# EAGLE design Adafruit MCP4728 (EAGLE 9.5.1)
COMPANY: ADAFRUIT INDUSTRIES; DRAWN: KTOWN; REV: A
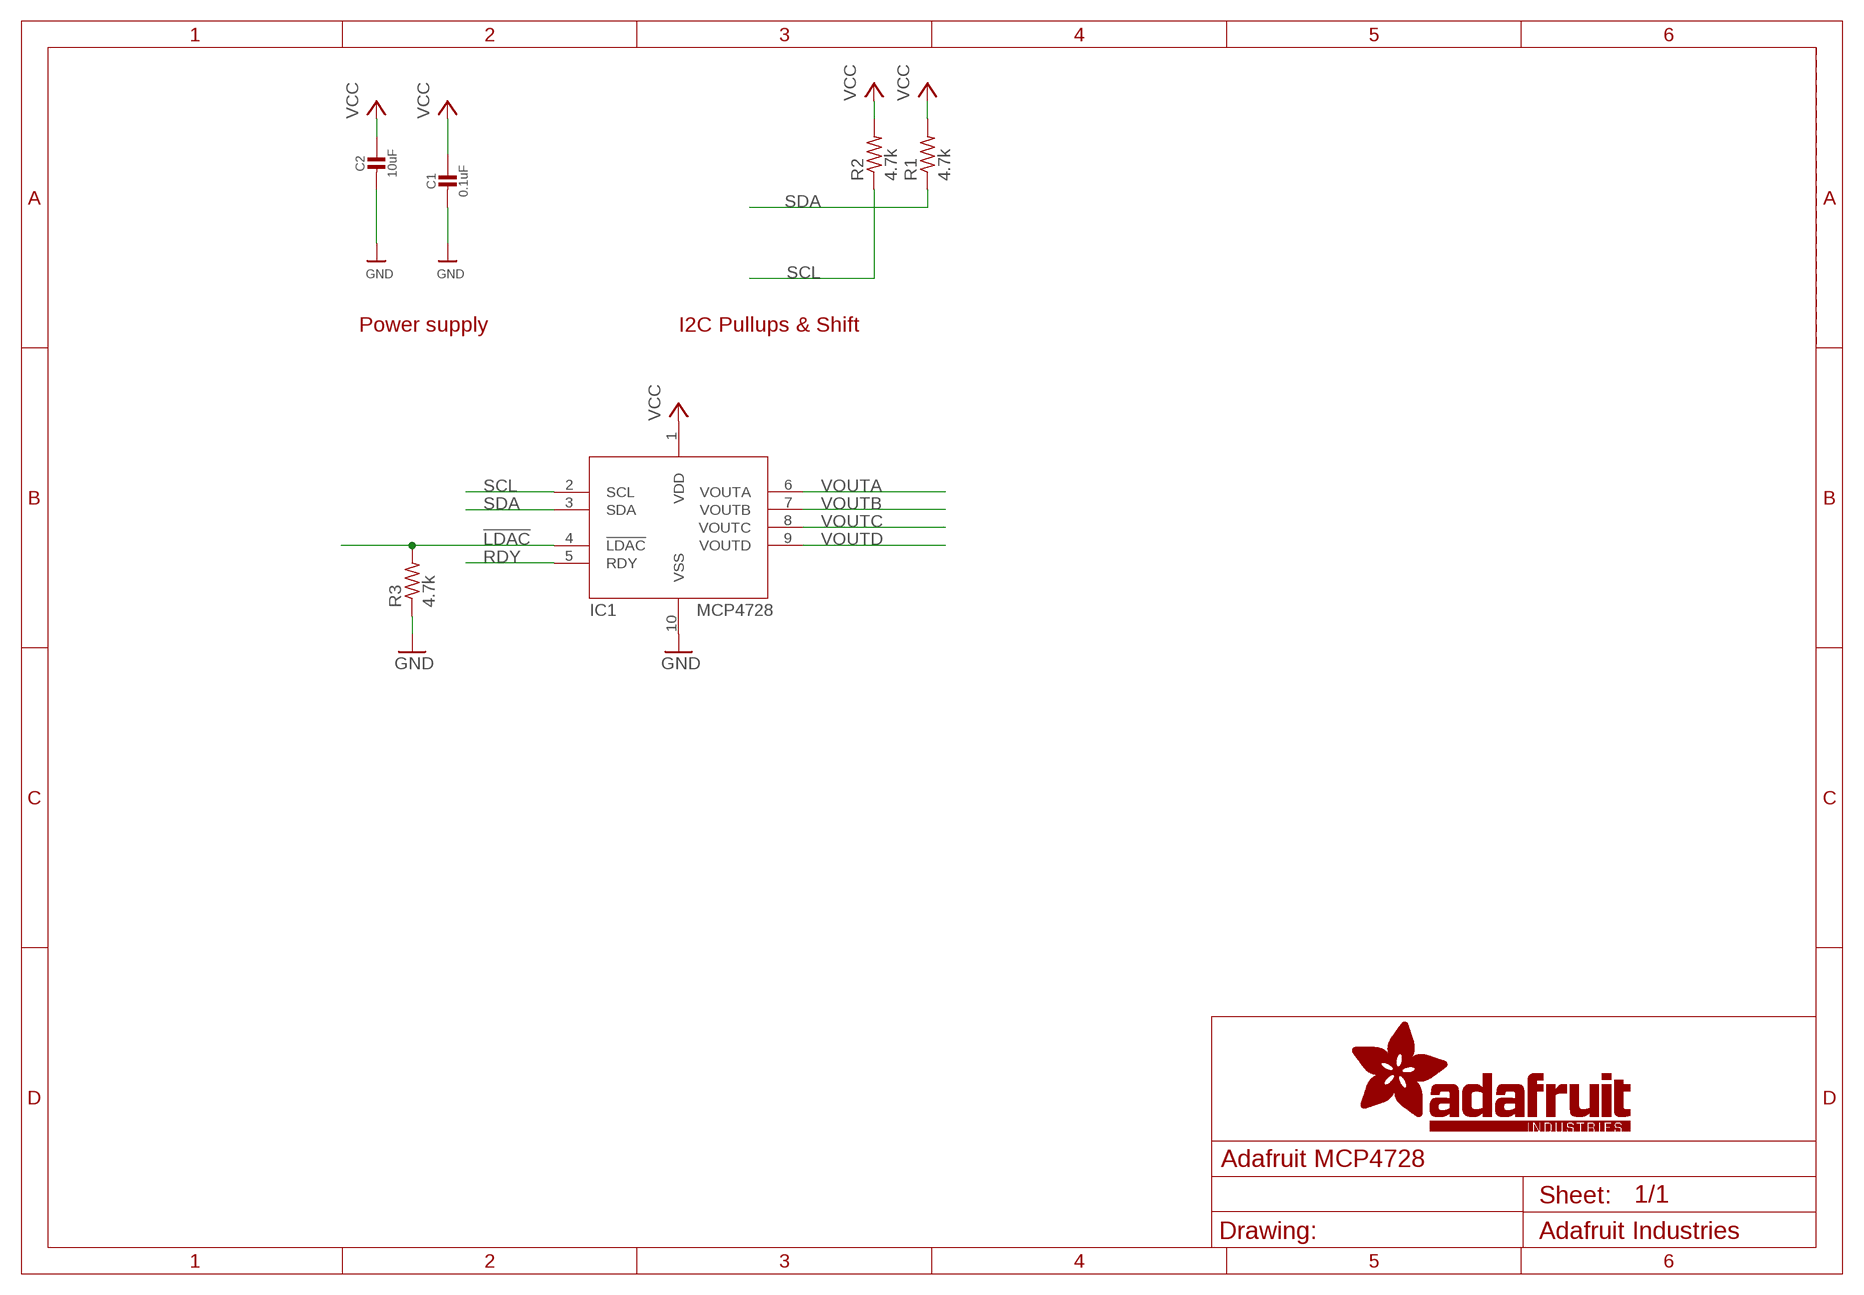
[diagram p0: schematic, sheet 1]

## Parts
C1  0.1uF  CAP_CERAMIC0603_NO  [0603-NO]
C2  10uF  CAP_CERAMIC0805-NOOUTLINE  [0805-NO]
IC1  MCP4728  [MSOP10]
R1  4.7k  R-US_0204/7  [0204/7]
R2  4.7k  R-US_0204/7  [0204/7]
R3  4.7k  R-US_0204/7  [0204/7]

## Nets
!LDAC: IC1.4(!LDAC) R3.2
GND [lowpower]: C1.2 C2.2 IC1.10(VSS) R3.1
RDY: IC1.5(RDY)
SCL: IC1.2(SCL) R2.1
SDA: IC1.3(SDA) R1.1
VCC [lowpower]: C1.1 C2.1 IC1.1(VDD) R1.2 R2.2
VOUTA: IC1.6(VOUTA)
VOUTB: IC1.7(VOUTB)
VOUTC: IC1.8(VOUTC)
VOUTD: IC1.9(VOUTD)

## Notes on the sheet
- Power supply | I2C Pullups & Shift

## Library data of the parts
C1 C2 = microbuilder:CAP_CERAMIC: Ceramic Capacitors For new designs, use the packages preceded by an '_' character since they are more reliable: The following footprints should be used on most boards: _0402 - Standard footprint for regular board layouts _0603 - Standard footprint for regular board layouts _0805 - Standard footprint for regular board layouts _1206 - Standard footprint for regular board layouts For extremely tight-pitch boards where space is at a premium, the following 'micro-pitch' footprints can be used (smaller pads, no silkscreen outline, etc.): _0402MP - Micro-pitch footprint for very dense/compact boards _0603MP - Micro-pitch footprint for very dense/compact boards _0805MP - Micro-pitch footprint for very dense/compact boards _1206MP - Micro-pitch footprint for very dense/compact boards
IC1 = microbuilder:MCP4728
R1-R3 = rcl:R-US_: RESISTOR, American symbol; SPICEPREFIX: R

## Net classes
1 highpower: width 0.406 mm, drill 0.483 mm
2 lowpower: width 0.305 mm, drill 0.483 mm

## Board
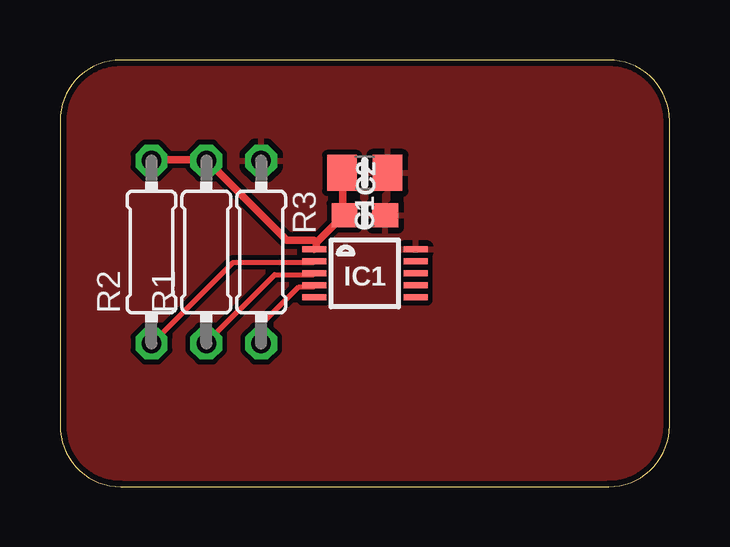
[diagram p1: board, top side]
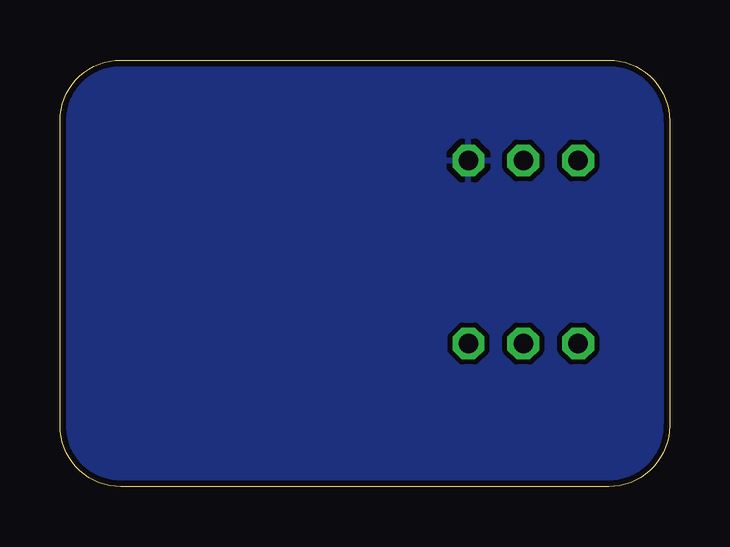
[diagram p2: board, bottom side, seen from below]

Size 25.4 x 17.78 mm. Coordinates in mm from the lower left corner, seen from the top.
Outline: 0,15.24 0,2.54 arc90 2.54,0 22.86,0 arc90 25.4,2.54 25.4,15.24 arc90 22.86,17.78 2.54,17.78 arc90 0,15.24
Copper layers (1*16): Top 0.035mm / dielectric 1.5mm / Bottom 0.035mm
Design rules "adafruit *": minimum track width 8mil, minimum drill 15.5mil, track to track 8mil, track to pad 8mil, pad to pad 8mil, via to via 8mil, smd to smd 8mil, copper to edge 10mil, drill to drill 8mil, minimum pad ring 10mil, minimum via ring 8mil, stop-mask expansion 2mil, vias tented up to drill 20mil, thermal gap 10mil

### Footprints (pad centres in the part's own frame; a part is rotated, then mirrored left to right if it is on the bottom)
0603-NO = smd 1.075 x 1: 1 -0.85,0; 2 0.85,0
0805-NO = smd 1.24 x 1.5: 1 -0.95,0; 2 0.95,0
MSOP10 = smd 0.25 x 1: 1 -1,-2.113; 2 -0.5,-2.113; 3 0,-2.113; 4 0.5,-2.113; 5 1,-2.113; 6 1,2.113; 7 0.5,2.113; 8 0,2.113; 9 -0.5,2.113; 10 -1,2.113
0204/7 = drill 0.813 octagon: 1 -3.81,0; 2 3.81,0

### Placement (x,y rotation side)
C1  12.7,11.3 0 top
C2  12.7,13.08 0 top
IC1  12.7,8.89 270 top
R1  6.1,9.78 90 top
R2  3.81,9.78 90 top
R3  8.38,9.78 270 top

### Tracks (layer width: path | path; a pad name or v marks a point on that pad's centre or on a via)
!LDAC
  Top 0.203: IC1.4 10.57,8.33 9.96,8.33 8.43,6.81 8.43,5.99 R3.2
GND
  pour Top: 0,17.78 25.4,17.78 25.4,0 0,0
  pour Bottom: 0,17.78 25.4,17.78 25.4,0 0,0
SCL
  Top 0.203: IC1.2 10.57,9.35 7.21,9.35 3.86,5.99 R2.1
SDA
  Top 0.203: IC1.3 10.57,8.84 8.94,8.84 6.1,5.99 R1.1
VCC
  Top 0.305: 10.67,10.16 10.67,9.96 IC1.1 | 10.67,10.16 11.79,11.28 C1.1 11.79,11.38 11.79,13.01 C2.1 | R2.2 3.86,13.61 6.1,13.61 R1.2 6.2,13.51 9.45,10.26 10.57,10.26 10.67,10.16